# EAGLE design LayerOne_2011_bkt (EAGLE 5.11)
MF: VISHAY/DALE; MPN: CRCW080510K0FKEA; OC_NEWARK: 52K9795

## Sheet 1 of 4
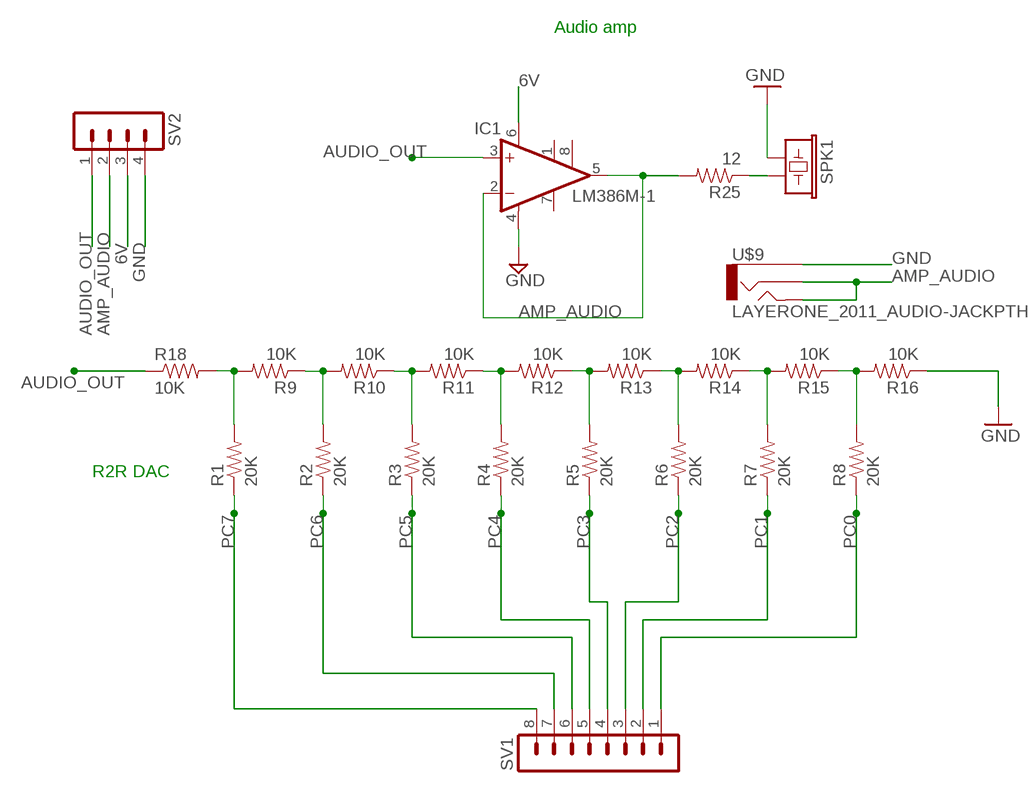
[diagram p0: schematic, sheet 1]

### Parts
IC1  LM386M-1  [SO08]
R1  20K  RESISTOR  [0805]
R2  20K  RESISTOR  [0805]
R3  20K  RESISTOR  [0805]
R4  20K  RESISTOR  [0805]
R5  20K  RESISTOR  [0805]
R6  20K  RESISTOR  [0805]
R7  20K  RESISTOR  [0805]
R8  20K  RESISTOR  [0805]
R9  10K  RESISTOR  [0805]
R10  10K  RESISTOR  [0805]
R11  10K  RESISTOR  [0805]
R12  10K  RESISTOR  [0805]
R13  10K  RESISTOR  [0805]
R14  10K  RESISTOR  [0805]
R15  10K  RESISTOR  [0805]
R16  10K  RESISTOR  [0805]
R18  10K  RESISTOR  [0805]
R25  12  RESISTOR  [0805]
SPK1  BUZZERSMD2  [BUZZER-CCV]
SV1  MA08-1  [MA08-1]
SV2  MA04-1  [MA04-1]
U$9  LAYERONE_2011_AUDIO-JACKPTH  [LAYERONE_2011_AUDIO-JACK]

### Nets
6V: IC1.6(VS) SV2.3
AMP_AUDIO: IC1.2(-IN) IC1.5(OUT) R25.2 SV2.2 U$9.2 U$9.5
AUDIO_OUT: IC1.3(+IN) R18.1 SV2.1
GND: IC1.4(GND) R16.1 SPK1.+ SV2.4 U$9.1 ; also sheet 4
N$1: R2.2 R9.1 R10.2
N$2: R3.2 R10.1 R11.2
N$3: R4.2 R11.1 R12.2
N$4: R5.2 R12.1 R13.2
N$5: R6.2 R13.1 R14.2
N$6: R7.2 R14.1 R15.2
N$7: R8.2 R15.1 R16.2
N$8: R25.1 SPK1.-
N$53: R1.2 R9.2 R18.2
PC0: R8.1 SV1.1
PC1: R7.1 SV1.2
PC2: R6.1 SV1.3
PC3: R5.1 SV1.4
PC4: R4.1 SV1.5
PC5: R3.1 SV1.6
PC6: R2.1 SV1.7
PC7: R1.1 SV1.8
Unconnected: IC1.1(GAIN) IC1.7(BYPASS) IC1.8(GAIN)

### Notes on the sheet
- Audio amp
- R2R DAC

## Sheet 2 of 4
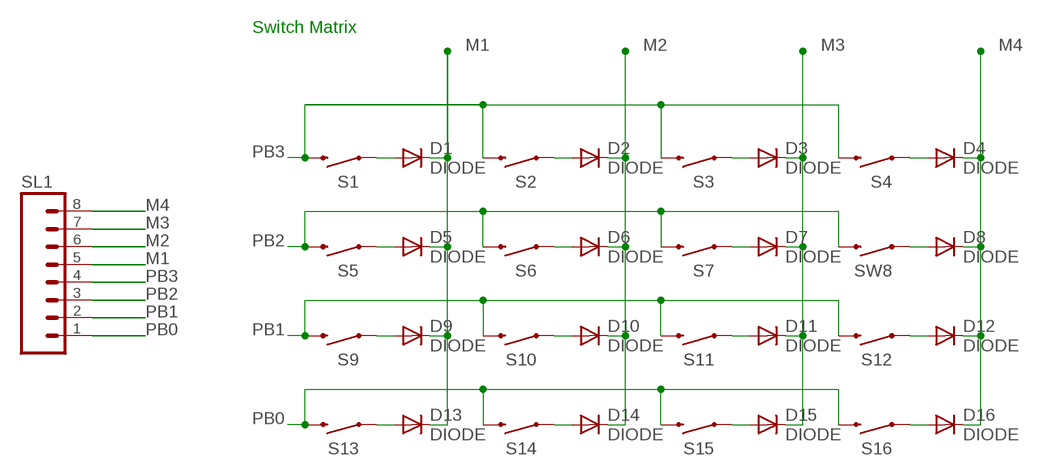
[diagram p1: schematic, sheet 2]

### Parts
D1  DIODE  DIODESOD  [SOD-323]
D2  DIODE  DIODESOD  [SOD-323]
D3  DIODE  DIODESOD  [SOD-323]
D4  DIODE  DIODESOD  [SOD-323]
D5  DIODE  DIODESOD  [SOD-323]
D6  DIODE  DIODESOD  [SOD-323]
D7  DIODE  DIODESOD  [SOD-323]
D8  DIODE  DIODESOD  [SOD-323]
D9  DIODE  DIODESOD  [SOD-323]
D10  DIODE  DIODESOD  [SOD-323]
D11  DIODE  DIODESOD  [SOD-323]
D12  DIODE  DIODESOD  [SOD-323]
D13  DIODE  DIODESOD  [SOD-323]
D14  DIODE  DIODESOD  [SOD-323]
D15  DIODE  DIODESOD  [SOD-323]
D16  DIODE  DIODESOD  [SOD-323]
S1  SWITCH-MOMENTARY-2SMD  [TACTILE_SWITCH_SMD]
S2  SWITCH-MOMENTARY-2SMD  [TACTILE_SWITCH_SMD]
S3  SWITCH-MOMENTARY-2SMD  [TACTILE_SWITCH_SMD]
S4  SWITCH-MOMENTARY-2SMD  [TACTILE_SWITCH_SMD]
S5  SWITCH-MOMENTARY-2SMD  [TACTILE_SWITCH_SMD]
S6  SWITCH-MOMENTARY-2SMD  [TACTILE_SWITCH_SMD]
S7  SWITCH-MOMENTARY-2SMD  [TACTILE_SWITCH_SMD]
S9  SWITCH-MOMENTARY-2SMD  [TACTILE_SWITCH_SMD]
S10  SWITCH-MOMENTARY-2SMD  [TACTILE_SWITCH_SMD]
S11  SWITCH-MOMENTARY-2SMD  [TACTILE_SWITCH_SMD]
S12  SWITCH-MOMENTARY-2SMD  [TACTILE_SWITCH_SMD]
S13  SWITCH-MOMENTARY-2SMD  [TACTILE_SWITCH_SMD]
S14  SWITCH-MOMENTARY-2SMD  [TACTILE_SWITCH_SMD]
S15  SWITCH-MOMENTARY-2SMD  [TACTILE_SWITCH_SMD]
S16  SWITCH-MOMENTARY-2SMD  [TACTILE_SWITCH_SMD]
SL1  M08  [1X08]
SW8  SWITCH-MOMENTARY-2SMD  [TACTILE_SWITCH_SMD]

### Nets
M1: D1.1(C) D5.1(C) D9.1(C) D13.1(C) SL1.5
M2: D2.1(C) D6.1(C) D10.1(C) D14.1(C) SL1.6
M3: D3.1(C) D7.1(C) D11.1(C) D15.1(C) SL1.7
M4: D4.1(C) D8.1(C) D12.1(C) D16.1(C) SL1.8
N$13: D1.2(A) S1.1
N$16: D2.2(A) S2.1
N$17: D3.2(A) S3.1
N$18: D4.2(A) S4.1
N$19: D5.2(A) S5.1
N$20: D6.2(A) S6.1
N$21: D7.2(A) S7.1
N$22: D8.2(A) SW8.1
N$23: D9.2(A) S9.1
N$24: D10.2(A) S10.1
N$25: D11.2(A) S11.1
N$26: D12.2(A) S12.1
N$33: D13.2(A) S13.1
N$34: D14.2(A) S14.1
N$35: D15.2(A) S15.1
N$36: D16.2(A) S16.1
PB0: S13.3 S14.3 S15.3 S16.3 SL1.1
PB1: S9.3 S10.3 S11.3 S12.3 SL1.2
PB2: S5.3 S6.3 S7.3 SL1.3 SW8.3
PB3: S1.3 S2.3 S3.3 S4.3 SL1.4

### Notes on the sheet
- Switch Matrix

## Sheet 3 of 4
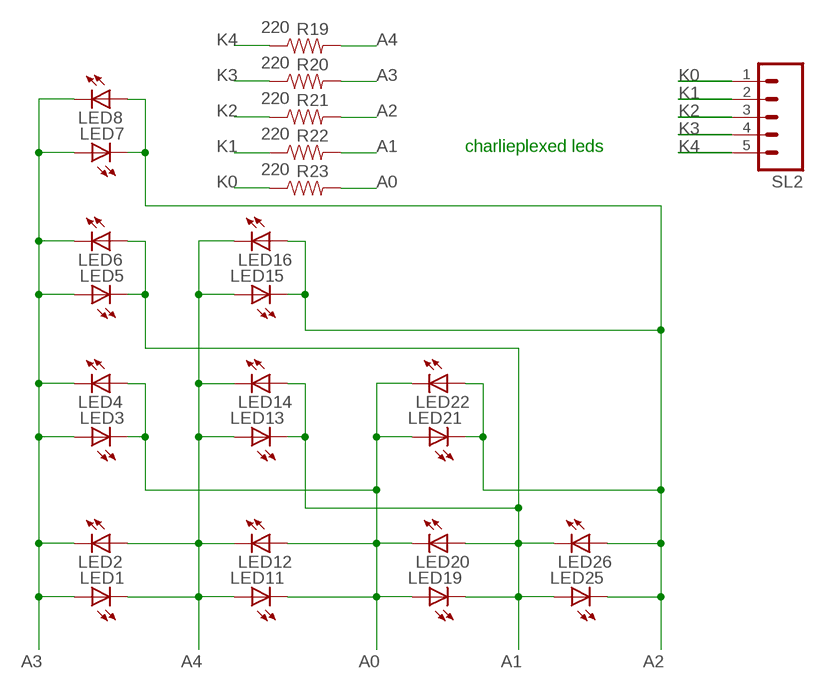
[diagram p2: schematic, sheet 3]

### Parts
LED1  LEDCHIPLED_1206  [CHIPLED_1206]
LED2  LEDCHIPLED_1206  [CHIPLED_1206]
LED3  LEDCHIPLED_1206  [CHIPLED_1206]
LED4  LEDCHIPLED_1206  [CHIPLED_1206]
LED5  LEDCHIPLED_1206  [CHIPLED_1206]
LED6  LEDCHIPLED_1206  [CHIPLED_1206]
LED7  LEDCHIPLED_1206  [CHIPLED_1206]
LED8  LEDCHIPLED_1206  [CHIPLED_1206]
LED11  LEDCHIPLED_1206  [CHIPLED_1206]
LED12  LEDCHIPLED_1206  [CHIPLED_1206]
LED13  LEDCHIPLED_1206  [CHIPLED_1206]
LED14  LEDCHIPLED_1206  [CHIPLED_1206]
LED15  LEDCHIPLED_1206  [CHIPLED_1206]
LED16  LEDCHIPLED_1206  [CHIPLED_1206]
LED19  LEDCHIPLED_1206  [CHIPLED_1206]
LED20  LEDCHIPLED_1206  [CHIPLED_1206]
LED21  LEDCHIPLED_1206  [CHIPLED_1206]
LED22  LEDCHIPLED_1206  [CHIPLED_1206]
LED25  LEDCHIPLED_1206  [CHIPLED_1206]
LED26  LEDCHIPLED_1206  [CHIPLED_1206]
R19  220  RESISTOR  [0805]
R20  220  RESISTOR  [0805]
R21  220  RESISTOR  [0805]
R22  220  RESISTOR  [0805]
R23  220  RESISTOR  [0805]
SL2  M05LOCK  [1X05_LOCK]

### Nets
A0 [LED]: LED3.C LED4.A LED11.C LED12.A LED19.A LED20.C LED21.A LED22.C R23.2
A1: LED5.C LED6.A LED13.C LED14.A LED19.C LED20.A LED25.A LED26.C R22.2
A2: LED7.C LED8.A LED15.C LED16.A LED21.C LED22.A LED25.C LED26.A R21.2
A3: LED1.A LED2.C LED3.A LED4.C LED5.A LED6.C LED7.A LED8.C R20.2
A4: LED1.C LED2.A LED11.A LED12.C LED13.A LED14.C LED15.A LED16.C R19.2
K0 [LED]: R23.1 SL2.1
K1 [LED]: R22.1 SL2.2
K2 [LED]: R21.1 SL2.3
K3 [LED]: R20.1 SL2.4
K4 [LED]: R19.1 SL2.5

### Notes on the sheet
- charlieplexed leds

## Sheet 4 of 4
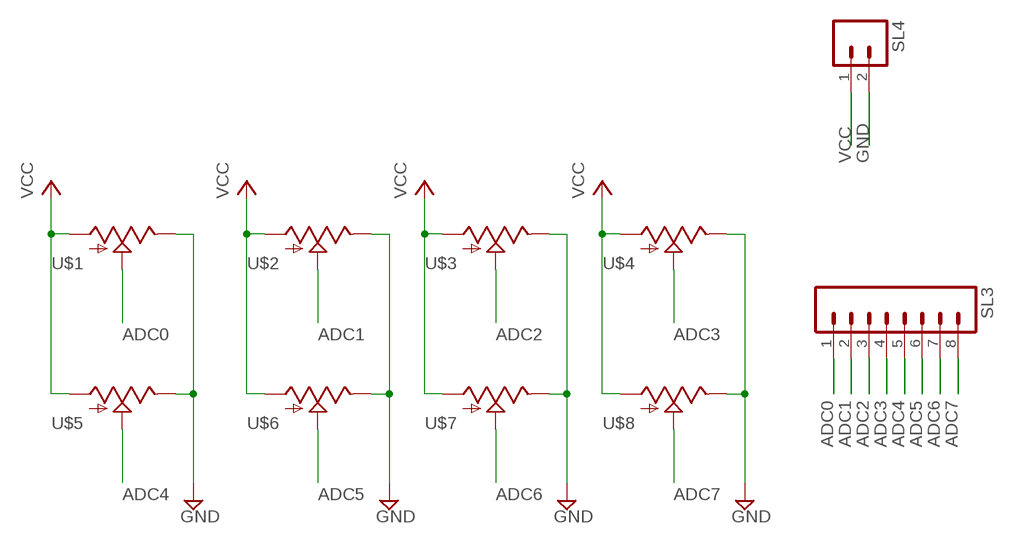
[diagram p3: schematic, sheet 4]

### Parts
SL3  M08  [1X08]
SL4  M02LOCK  [1X02_LOCK]
U$1  LAYERONE_2011_POTPOT_GOLD  [LAYERONE_2011_POT_GOLD]
U$2  LAYERONE_2011_POTPOT_GOLD  [LAYERONE_2011_POT_GOLD]
U$3  LAYERONE_2011_POTPOT_GOLD  [LAYERONE_2011_POT_GOLD]
U$4  LAYERONE_2011_POTPOT_GOLD  [LAYERONE_2011_POT_GOLD]
U$5  LAYERONE_2011_POTPOT_GOLD  [LAYERONE_2011_POT_GOLD]
U$6  LAYERONE_2011_POTPOT_GOLD  [LAYERONE_2011_POT_GOLD]
U$7  LAYERONE_2011_POTPOT_GOLD  [LAYERONE_2011_POT_GOLD]
U$8  LAYERONE_2011_POTPOT_GOLD  [LAYERONE_2011_POT_GOLD]

### Nets
ADC0: SL3.1 U$1.P$2(S)
ADC1: SL3.2 U$2.P$2(S)
ADC2: SL3.3 U$3.P$2(S)
ADC3: SL3.4 U$4.P$2(S)
ADC4: SL3.5 U$5.P$2(S)
ADC5: SL3.6 U$6.P$2(S)
ADC6: SL3.7 U$7.P$2(S)
ADC7: SL3.8 U$8.P$2(S)
GND: SL4.2 U$1.P$3(E) U$2.P$3(E) U$3.P$3(E) U$4.P$3(E) U$5.P$3(E) U$6.P$3(E) U$7.P$3(E) U$8.P$3(E) ; also sheet 1
VCC: SL4.1 U$1.P$1(A) U$2.P$1(A) U$3.P$1(A) U$4.P$1(A) U$5.P$1(A) U$6.P$1(A) U$7.P$1(A) U$8.P$1(A)

## Library data of the parts
D1-D16 = SparkFun:DIODE: Diode These are standard reverse protection diodes and small signal diodes. SMA package can handle up to about 1A. SOD-323 can handle about 200mA. What the SOD-323 package when ordering, there are some mfgs out there that are 5-pin packages.
IC1 = LayerOne_2011:LM386?-*: Low Voltage Audio Power Amplifier Source: http://cache.national.com/ds/LM/LM386.pdf
LED1-LED8 LED11-LED16 LED19-LED22 LED25 LED26 = led:LED: LED OSRAM: - CHIPLED LG R971, LG N971, LY N971, LG Q971, LY Q971, LO R971, LY R971 LH N974, LH R974 LS Q976, LO Q976, LY Q976 LO Q996 - Hyper CHIPLED LW Q18S LB Q993, LB Q99A, LB R99A - SideLED LS A670, LO A670, LY A670, LG A670, LP A670 LB A673, LV A673, LT A673, LW A673 LH A674 LY A675 LS A676, LA A676, LO A676, LY A676, LW A676 LS A679, LY A679, LG A679 - Hyper Micro SIDELED® LS Y876, LA Y876, LO Y876, LY Y876 LT Y87S - SmartLED LW L88C, LW L88S LB L89C, LB L89S, LG L890 LS L89K, LO L89K, LY L89K LS L896, LA L896, LO L896, LY L896 - TOPLED LS T670, LO T670, LY T670, LG T670, LP T670 LSG T670, LSP T670, LSY T670, LOP T670, LYG T670 LG T671, LOG T671, LSG T671 LB T673, LV T673, LT T673, LW T673 LH T674 LS T676, LA T676, LO T676, LY T676, LB T676, LH T676, LSB T676, LW T676 LB T67C, LV T67C, LT T67C, LS T67K, LO T67K, LY T67K, LW E67C LS E67B, LA E67B, LO E67B, LY E67B, LB E67C, LV E67C, LT E67C LW T67C LS T679, LY T679, LG T679 LS T770, LO T770, LY T770, LG T770, LP T770 LB T773, LV T773, LT T773, LW T773 LH T774 LS E675, LA E675, LY E675, LS T675 LS T776, LA T776, LO T776, LY T776, LB T776 LHGB T686 LT T68C, LB T68C - Hyper Mini TOPLED® LB M676 - Mini TOPLED Santana® LG M470 LS M47K, LO M47K, LY M47K Source: http://www.osram.convergy.de LUXEON: - LUMILED® LXK2-PW12-R00, LXK2-PW12-S00, LXK2-PW14-U00, LXK2-PW14-V00 LXK2-PM12-R00, LXK2-PM12-S00, LXK2-PM14-U00 LXK2-PE12-Q00, LXK2-PE12-R00, LXK2-PE12-S00, LXK2-PE14-T00, LXK2-PE14-U00 LXK2-PB12-K00, LXK2-PB12-L00, LXK2-PB12-M00, LXK2-PB14-N00, LXK2-PB14-P00, LXK2-PB14-Q00 LXK2-PR12-L00, LXK2-PR12-M00, LXK2-PR14-Q00, LXK2-PR14-R00 LXK2-PD12-Q00, LXK2-PD12-R00, LXK2-PD12-S00 LXK2-PH12-R00, LXK2-PH12-S00 LXK2-PL12-P00, LXK2-PL12-Q00, LXK2-PL12-R00 Source: www.luxeon.com KINGBRIGHT: KA-3528ASYC Source: www.kingbright.com
R1-R16 R25 = SparkFun:RESISTOR: Resistor Basic schematic elements and footprints for 0603, 1206, and PTH 1/10th watt (small) resistors.
R18 = LayerOne_2011:RESISTOR: Resistor Basic schematic elements and footprints for 0603, 1206, and PTH 1/10th watt (small) resistors.
R19-R23 = NSL:RESISTOR: Resistor Basic schematic elements and footprints for 0603, 1206, and PTH 1/10th watt (small) resistors.
S1-S7 S9-S16 SW8 = LayerOne_2011:SWITCH-MOMENTARY-2
SL1 SL3 = SparkFun:M08: Header 8 Standard 8-pin 0.1" header. Use with straight break away headers (SKU : PRT-00116), right angle break away headers (PRT-00553), swiss pins (PRT-00743), machine pins (PRT-00117), and female headers (PRT-00115).
SL2 = SparkFun:M05: Header 5 Standard 5-pin 0.1" header. Use with straight break away headers (SKU : PRT-00116), right angle break away headers (PRT-00553), swiss pins (PRT-00743), machine pins (PRT-00117), and female headers (PRT-00115). Molex polarized connector foot print use with SKU : PRT-08230 with associated crimp pins and housings.
SL4 = SparkFun:M02: Header 2 Standard 2-pin 0.1" header. Use with straight break away headers (SKU : PRT-00116), right angle break away headers (PRT-00553), swiss pins (PRT-00743), machine pins (PRT-00117), and female headers (PRT-00115). Molex polarized connector foot print use with SKU : PRT-08233 with associated crimp pins and housings.
SPK1 = LayerOne_2011:BUZZER: Buzzer 12mm Spark Fun Electronics SKU : Comp-Buzzer
SV1 = con-lstb:MA08-1: PIN HEADER; OC_FARNELL: unknown; OC_NEWARK: unknown
SV2 = con-lstb:MA04-1: PIN HEADER; OC_FARNELL: unknown; OC_NEWARK: unknown
U$1-U$8 = LayerOne_2011:LAYERONE_2011_POT
U$9 = LayerOne_2011:LAYERONE_2011_AUDIO-JACK: 3.5mm Audio Jack Simple 3.5mm common PCB mount audio jack. SKU: PRT-08032

## Net classes
0 default: width 0.406 mm
1 LED: width 0.305 mm

## Board
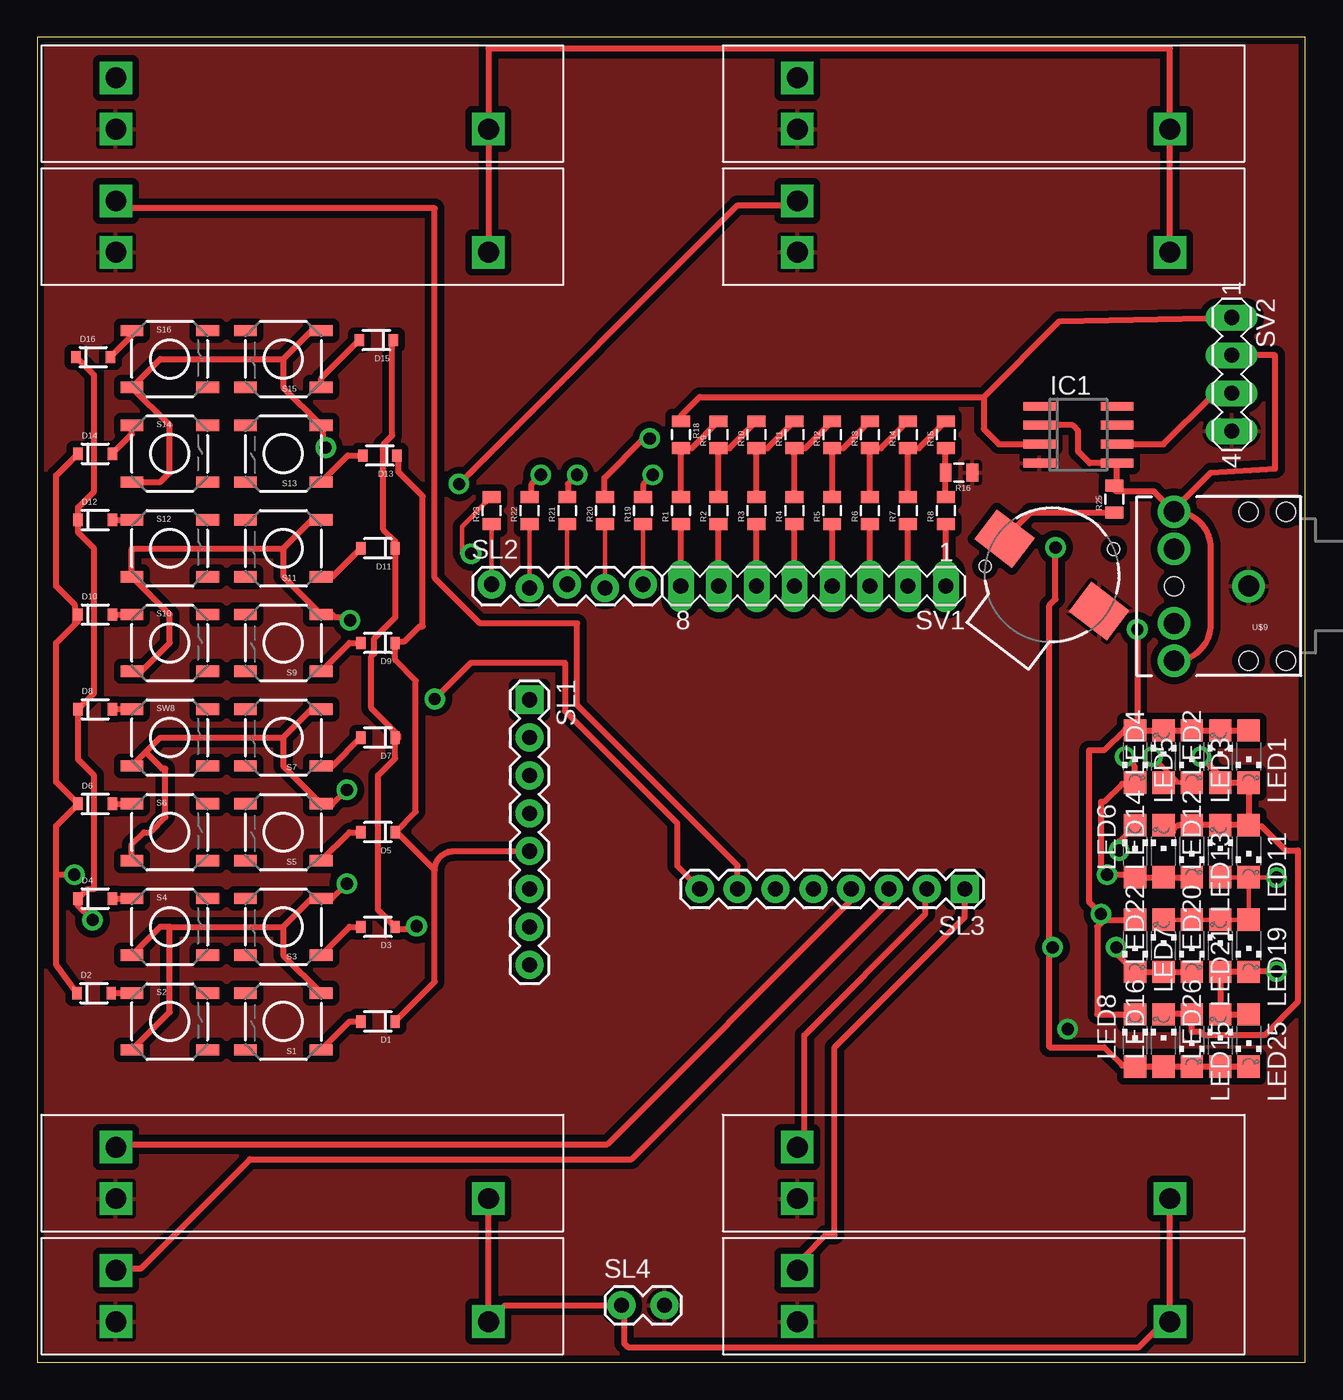
[diagram p4: board, top side]
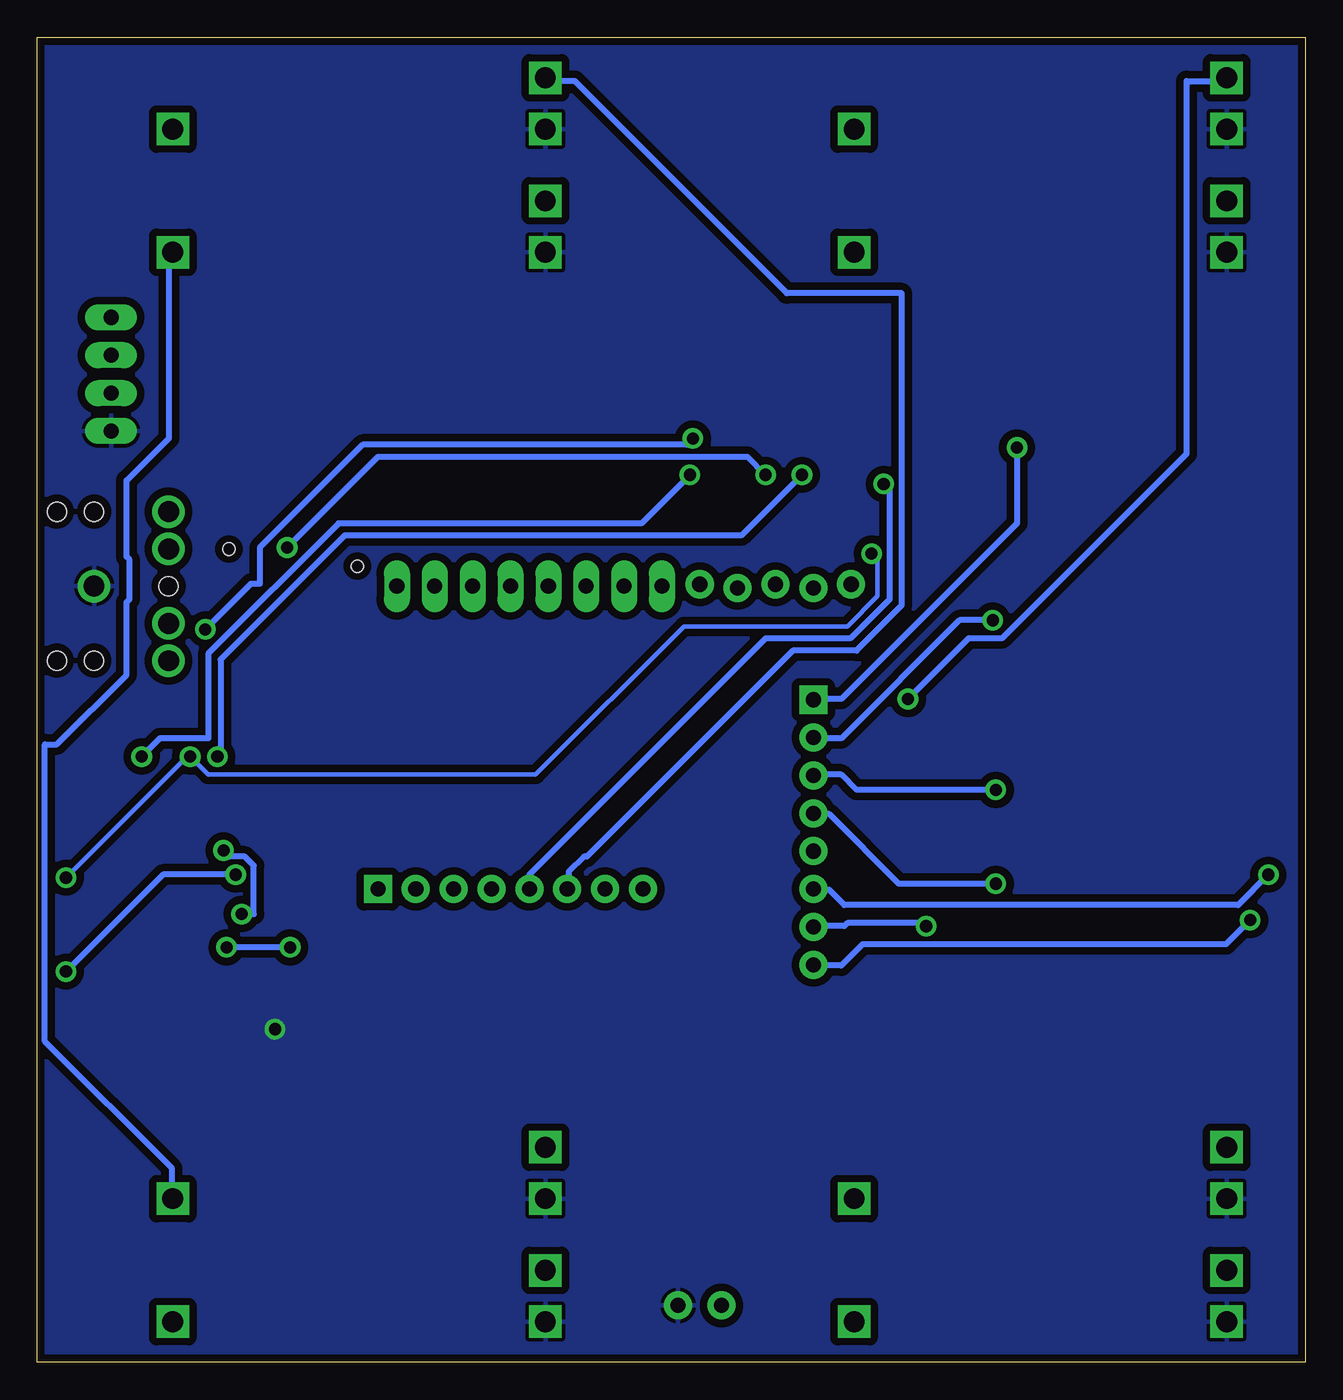
[diagram p5: board, bottom side, seen from below]

Size 85.09 x 88.9 mm. Coordinates in mm from the lower left corner, seen from the top.
Outline: 0,0 85.09,0 85.09,88.9 0,88.9 0,0
Copper layers (1*16): Top 0.0356mm / dielectric 1.5011mm / Bottom 0.0356mm
Design rules "SparkFun-mod *": minimum track width 8mil, minimum drill 32mil, track to track 14mil, track to pad 14mil, pad to pad 12mil, via to via 12mil, smd to smd 8mil, copper to edge 12mil, drill to drill 8mil, minimum pad ring 14mil, minimum via ring 10mil, stop-mask expansion 4mil, vias tented up to drill 34mil, thermal gap 10mil
Milling: 4 lines

### Footprints (pad centres in the part's own frame; a part is rotated, then mirrored left to right if it is on the bottom)
SOD-323 = smd 0.63 x 0.83: 1 -1.15,0; 2 1.15,0
SO08 = smd 0.6 x 2.2: 1 -1.905,-2.6; 2 -0.635,-2.6; 3 0.635,-2.6; 4 1.905,-2.6; 5 1.905,2.6; 6 0.635,2.6; 7 -0.635,2.6; 8 -1.905,2.6
CHIPLED_1206 = smd 1.5 x 1.5: A 0,-1.75; C 0,1.75
0805 = smd 0.8 x 1.2: 1 -0.9,0; 2 0.9,0
TACTILE_SWITCH_SMD = smd 1.524 x 0.762: 1 -2.54,1.905; 2 2.54,1.905; 3 -2.54,-1.905; 4 2.54,-1.905
1X08 = drill 1.016 pad 1.88 square: 1 0,0 | drill 1.016 pad 1.88 round: 2 2.54,0; 3 5.08,0; 4 7.62,0; 5 10.16,0; 6 12.7,0; 7 15.24,0; 8 17.78,0
1X05_LOCK = drill 1.016 pad 1.88 round: 1 0,0.127; 2 2.54,-0.127; 3 5.08,0.127; 4 7.62,-0.127; 5 10.16,0.127
1X02_LOCK = drill 1.016 pad 1.88 round: 1 -0.178,0; 2 2.718,0
BUZZER-CCV = smd 3.2 x 2.5: + 4,0; - -4,0 | hole 0.813: -3.9,-2.25; 2.25,3.9
MA08-1 = drill 1.016 long: 1 -8.89,0; 2 -6.35,0; 3 -3.81,0; 4 -1.27,0; 5 1.27,0; 6 3.81,0; 7 6.35,0; 8 8.89,0
MA04-1 = drill 1.016 long: 1 -3.81,0; 2 -1.27,0; 3 1.27,0; 4 3.81,0
LAYERONE_2011_POT_GOLD = drill 1.397 square: P$1 12.5,-1.72; P$2 -12.5,1.72; P$3 -12.5,-1.72
LAYERONE_2011_AUDIO-JACK = drill 1.397 pad 2.184 round: 1 0,0; 2 5,5; 3 5,2.5; 4 5,-2.5; 5 5,-5 | hole 1.27: 0,5; -2.5,5; -2.5,-5; 0,-5; 5,0

### Placement (x,y rotation side)
D1  22.86,22.86 180 top
D2  3.81,24.77 0 top
D3  22.86,29.21 180 top
D4  3.89,31.11 0 top
D5  22.86,35.56 180 top
D6  3.89,37.47 0 top
D7  22.86,41.91 180 top
D8  3.89,43.81 0 top
D9  22.86,48.26 180 top
D10  3.89,50.16 0 top
D11  22.86,54.61 180 top
D12  3.89,56.52 0 top
D13  22.99,60.83 180 top
D14  3.89,60.96 0 top
D15  22.75,68.58 180 top
D16  3.76,67.44 0 top
IC1  69.85,62.23 270 top
LED1  81.28,40.64 180 top
LED2  79.38,40.64 0 top
LED3  77.47,40.64 180 top
LED4  75.56,40.64 0 top
LED5  73.66,40.64 180 top
LED6  73.66,34.29 0 top
LED7  73.66,27.94 180 top
LED8  73.66,21.59 0 top
LED11  81.28,34.29 180 top
LED12  79.38,34.29 0 top
LED13  77.47,34.29 180 top
LED14  75.56,34.29 0 top
LED15  77.47,21.59 180 top
LED16  75.56,21.59 0 top
LED19  81.28,27.94 180 top
LED20  79.38,27.94 0 top
LED21  77.47,27.94 180 top
LED22  75.56,27.94 0 top
LED25  81.28,21.59 180 top
LED26  79.38,21.59 0 top
R1  43.18,57.15 90 top
R2  45.72,57.15 90 top
R3  48.26,57.15 90 top
R4  50.8,57.15 90 top
R5  53.34,57.15 90 top
R6  55.88,57.15 90 top
R7  58.42,57.15 90 top
R8  60.96,57.15 90 top
R9  45.72,62.23 90 top
R10  48.26,62.23 90 top
R11  50.8,62.23 90 top
R12  53.34,62.23 90 top
R13  55.88,62.23 90 top
R14  58.42,62.23 90 top
R15  60.96,62.23 90 top
R16  61.85,59.69 180 top
R18  43.18,62.23 270 top
R19  40.64,57.15 90 top
R20  38.1,57.15 90 top
R21  35.56,57.15 90 top
R22  33.02,57.15 90 top
R23  30.48,57.15 90 top
R25  72.26,57.91 90 top
S1  16.51,22.86 180 top
S2  8.89,22.86 0 top
S3  16.51,29.21 180 top
S4  8.89,29.21 0 top
S5  16.51,35.56 180 top
S6  8.89,35.56 0 top
S7  16.51,41.91 180 top
S9  16.51,48.26 180 top
S10  8.89,48.26 0 top
S11  16.51,54.61 180 top
S12  8.89,54.61 0 top
S13  16.51,60.96 180 top
S14  8.89,60.96 0 top
S15  16.51,67.31 180 top
S16  8.89,67.31 0 top
SL1  33.02,44.45 270 top
SL2  30.48,52.07 0 top
SL3  62.23,31.75 180 top
SL4  39.37,3.81 0 top
SPK1  68.07,52.83 322.6 top
SV1  52.07,52.07 180 top
SV2  80.14,66.29 270 top
SW8  8.89,41.91 0 top
U$1  63.5,4.45 0 top
U$2  63.5,12.7 0 top
U$3  17.78,4.45 0 top
U$4  17.78,12.7 0 top
U$5  63.5,76.2 0 top
U$6  63.5,84.45 0 top
U$7  17.78,76.2 0 top
U$8  17.78,84.45 0 top
U$9  81.28,52.07 180 top

### Tracks (layer width: path | path; a pad name or v marks a point on that pad's centre or on a via)
6V
  Top 0.406: IC1.6 75.56,61.59 78.74,64.77 79.88,64.77 SV2.3
A0  (via drill 0.81)
  Top 0.305: LED11.C LED12.A | LED11.C LED19.A LED20.C LED21.A LED22.C | 76.45,38.89 LED4.A | 76.45,38.89 LED3.C | v29.11,54.25 28.5,54.25 28.5,56.08 30.33,57.91 R23.2 | v74.83,40.64 76.45,39.01 76.45,38.89 | v83.16,32.51 81.33,32.51 LED11.C
  Bottom 0.305: v29.11,54.25 28.7,53.85 28.7,51.41 30.73,49.38 41.71,49.38 51.66,39.42 73.61,39.42 v74.83,40.64 74.83,40.44 75.23,40.44 v83.16,32.51
A1  (via drill 0.81)
  Top 0.406: 80.01,23.34 LED26.C | 80.01,23.34 LED25.A | 80.01,23.34 arc-90 79.38,23.98 LED20.A LED19.C 81.33,26.21 v83.16,26.21 | LED13.C 77.47,32.51 75.64,32.51 LED14.A 75.44,32.51 73.81,32.51 LED6.A 73.61,32.72 71.98,32.72 71.88,32.82 | v33.78,59.54 33.17,58.93 33.17,58.12 R22.2 | v73,40.64 73.61,40.03 73.61,39.01 LED5.C 73.61,38.81 72.8,38.81 71.58,37.59 71.37,37.59 71.37,33.33 71.88,32.82 | 71.88,32.82 v71.78,32.72
  Bottom 0.406: v33.78,59.54 37.85,55.47 64.47,55.47 72.8,47.14 72.8,40.64 v73,40.64 | v83.16,26.21 76.66,32.72 v71.78,32.72
A2  (via drill 0.81)
  Top 0.406: LED25.C LED26.A LED15.C LED16.A LED8.A 73.61,19.91 72.8,19.91 71.58,21.13 67.92,21.13 67.92,27.84 | LED21.C LED22.A LED7.C 73.61,26.21 72.39,27.43 v72.39,27.84 | v36.22,59.54 35.61,58.93 35.61,58.12 R21.2 | v68.33,54.66 68.33,51.21 67.92,50.8 67.92,27.84 | 67.92,27.84 v68.12,27.84
  Bottom 0.406: v36.22,59.54 37.44,60.76 62.23,60.76 v68.33,54.66 | v68.12,27.84 v72.39,27.84
A3  (via drill 0.81)
  Top 0.406: LED8.C 71.12,23.34 71.12,29.21 71.6,29.69 | 71.6,29.69 LED7.A | LED1.A LED2.C LED3.A LED4.C LED5.A | v72.59,34.34 72.59,34.95 73.61,35.97 LED6.C | 71.6,29.69 71.58,29.87 v71.37,30.07 70.56,30.89 70.56,41.05 71.58,41.05 73,42.47 73.61,42.47 LED5.A | v41.1,61.98 40.69,61.98 38.05,59.33 38.05,58.12 R20.2 | v73.81,49.17 73.81,42.47 LED5.A
  Bottom 0.406: v72.59,34.34 72.19,33.93 71.17,33.93 70.56,33.33 70.56,30.07 v71.37,30.07 | v41.1,61.98 41.5,61.57 63.25,61.57 70.16,54.66 70.16,52.22 70.76,52.22 v73.81,49.17
A4  (via drill 0.81)
  Top 0.406: LED11.A LED1.C LED2.A 79.7,39.01 v78.08,40.64 | LED11.A LED12.C LED13.A 76.68,36.04 arc90 76.2,35.56 76.05,35.56 arc-90 LED14.C | LED16.C 75.64,23.37 77.47,23.37 LED15.A 77.47,22.15 78.08,22.15 78.28,21.95 82.35,21.95 84.58,24.18 84.58,34.34 83.77,34.34 82.14,35.97 81.33,35.97 LED11.A | v41.3,59.54 40.69,58.93 40.69,58.12 R19.2
  Bottom 0.406: v41.3,59.54 44.55,56.29 64.87,56.29 73.61,47.55 73.61,41.86 76.86,41.86 v78.08,40.64
ADC0
  Top 0.406: SL3.1 62.23,29.87 53.49,21.13 53.49,8.53 52.88,8.53 51.46,7.11 51.46,6.1 51.05,6.1 U$1.P$2
ADC1
  Top 0.406: SL3.2 59.59,31.7 59.59,30.07 51.46,21.95 51.46,14.43 51.05,14.43 U$2.P$2
ADC2
  Top 0.406: SL3.3 57.15,30.89 39.88,13.61 14.28,13.61 6.96,6.3 6.35,6.3 6.15,6.1 5.33,6.1 U$3.P$2
ADC3
  Top 0.406: SL3.4 54.51,31.7 54.51,30.89 38.25,14.63 6.35,14.63 6.15,14.43 5.33,14.43 U$4.P$2
ADC4  (via drill 0.81)
  Top 0.406: v28.3,58.93 46.99,77.62 50.04,77.62 50.24,77.83 50.85,77.83 U$5.P$2
  Bottom 0.406: v28.3,58.93 27.89,58.93 27.89,51.21 30.53,48.56 36.22,48.56 52.07,32.72 SL3.5
ADC5
  Bottom 0.406: SL3.6 49.43,31.9 49.43,32.92 48.41,33.93 48.21,33.93 34.39,47.75 30.12,47.75 27.08,50.8 27.08,71.73 34.8,71.73 49.02,85.95 50.04,85.95 50.24,86.16 50.85,86.16 U$6.P$2
ADC6
  Top 0.406: SL3.7 46.99,33.33 36.22,44.09 36.22,49.58 29.72,49.58 26.67,52.63 26.67,77.42 6.35,77.42 5.94,77.83 5.33,77.83 U$7.P$2
ADC7  (via drill 0.81)
  Top 0.406: v26.67,44.5 29.11,46.94 35.41,46.94 35.41,43.69 42.93,36.17 42.93,33.33 44.35,31.9 SL3.8
  Bottom 0.406: v26.67,44.5 22.61,48.56 20.37,48.56 7.98,60.96 7.98,85.95 6.35,85.95 6.15,86.16 5.33,86.16 U$8.P$2
AMP_AUDIO
  Top 0.406: IC1.2 69.47,62.87 69.85,62.48 69.85,61.09 70.61,60.33 IC1.5 72.45,59 R25.2 72.26,58.55 72.39,58.42 74.93,58.42 76.2,57.15 | 76.2,57.15 U$9.5 arc-90 78.74,54.61 78.74,49.53 arc-90 U$9.2 | SV2.2 83.06,67.56 83.06,59.94 78.74,59.69 76.2,57.15
AUDIO_OUT
  Top 0.406: R18.1 43.18,63.5 44.45,64.77 63.5,64.77 | 63.5,64.77 63.5,62.61 64.52,61.59 IC1.3 | SV2.1 68.58,69.85 63.5,64.77
GND  (via drill 0.81)
  other vias: 69.14,22.35
  pour Top (isolate 0.457): 85.09,88.9 0,88.9 0,0 85.09,0
  pour Bottom (isolate 0.508): 83.82,88.9 0,88.9 0,0 85.09,0 85.09,88.9
K0
  Top 0.305: SL2.1 R23.1
K1
  Top 0.305: SL2.2 R22.1
K2
  Top 0.305: SL2.3 R21.1
K3
  Top 0.305: SL2.4 38.1,55.88 38.05,55.88 38.05,56.08 R20.1
K4
  Top 0.305: SL2.5 40.64,55.88 40.69,55.88 40.69,56.08 R19.1
M1
  Top 0.406: D1.1 26.67,25.52 26.67,33.02 | 26.67,33.02 24.13,35.56 D5.1 25.4,36.95 25.4,45.72 24.01,47.11 D9.1 24.03,48.36 24.64,48.36 25.65,49.38 25.86,49.38 25.86,58.12 24.23,59.74 24.23,60.76 D13.1 | SL1.5 27.94,34.29 arc90 26.67,33.02
M2  (via drill 0.81)
  Top 0.406: D2.1 1.27,26.67 1.27,32.72 | 1.27,32.72 1.27,36 D6.1 1.27,38.93 1.27,48.26 2.54,49.53 | 2.54,49.53 2.74,49.73 D10.1 | D14.1 1.27,59.49 1.27,52.07 2.54,50.8 2.54,49.53 | 1.27,32.72 v2.49,32.72
  Bottom 0.406: v2.49,32.72 4.52,30.68 30.94,30.68 31.95,31.7 32.97,31.7 SL1.6
M3  (via drill 0.81)
  Top 0.406: D15.1 23.83,68.48 23.83,62.18 23.22,61.57 23.22,55.88 24.03,55.07 24.03,54.66 D11.1 24.03,54.46 24.03,49.99 22.61,48.56 22.61,47.55 22.4,47.35 22.4,43.89 24.23,42.06 24.23,41.86 24.03,41.86 D7.1 24.01,40.52 22.86,39.37 22.86,30.36 D3.1 24.03,29.06 25.25,29.06 v25.45,29.26
  Bottom 0.406: v25.45,29.26 25.65,29.46 30.73,29.46 30.94,29.26 32.97,29.26 SL1.7
M4  (via drill 0.81)
  Top 0.406: D16.1 3.81,66.24 3.81,58.42 2.74,57.35 D12.1 2.74,55.68 3.81,54.61 3.81,44.89 D8.1 2.74,40.44 3.81,39.37 3.81,31.75 3.37,31.75 D4.1 2.69,31.09 2.69,30.68 v3.71,29.67
  Bottom 0.406: v3.71,29.67 5.33,28.04 29.72,28.04 31.14,26.62 32.97,26.62 SL1.8
N$1
  Top 0.406: R2.2 R9.1 46.46,61.33 R10.2
N$2
  Top 0.406: R3.2 R10.1 49,61.33 R11.2
N$3
  Top 0.406: R4.2 R11.1 51.54,61.33 R12.2
N$4
  Top 0.406: R5.2 R12.1 54.08,61.33 R13.2
N$5
  Top 0.406: R6.2 R13.1 56.62,61.33 R14.2
N$6
  Top 0.406: R7.2 R14.1 59.16,61.33 R15.2
N$7
  Top 0.406: R8.2 R16.2 R15.1
N$8
  Top 0.406: R25.1 66.64,57.01 SPK1.-
N$13
  Top 0.406: S1.1 20.96,22.86 D1.2
N$16
  Top 0.406: D2.2 S2.1
N$17
  Top 0.406: S3.1 20.96,29.21 D3.2
N$18
  Top 0.406: D4.2 S4.1
N$19
  Top 0.406: S5.1 20.96,35.56 D5.2
N$20
  Top 0.406: D6.2 S6.1
N$21
  Top 0.406: D7.2 19.8,40.01 S7.1
N$22
  Top 0.406: D8.2 SW8.1
N$23
  Top 0.406: S9.1 20.96,48.26 D9.2
N$24
  Top 0.406: D10.2 S10.1
N$25
  Top 0.406: D11.2 19.8,52.7 S11.1
N$26
  Top 0.406: D12.2 S12.1
N$33
  Top 0.406: S13.1 20.83,60.83 D13.2
N$34
  Top 0.406: D14.2 6.35,62.27 S14.1
N$35
  Top 0.406: D15.2 19.05,66.03 S15.1
N$36
  Top 0.406: D16.2 6.35,68.88 S16.1
N$53
  Top 0.406: R1.2 R18.2 43.92,61.33 R9.2
PB0  (via drill 0.81)
  Top 0.406: S14.3 8.25,59.05 8.89,59.69 8.89,62.87 S16.3 8.25,67.31 16.51,67.31 | 16.51,67.31 18.42,69.22 S15.3 | 16.51,67.31 16.51,65.41 S13.3 19.15,62.79 19.15,61.57 v19.36,61.37
  Bottom 0.406: v19.36,61.37 19.36,56.29 31.14,44.5 32.97,44.5 SL1.1
PB1  (via drill 0.81)
  Top 0.406: 16.51,54.61 18.42,56.52 S11.3 | S10.3 6.98,46.35 8.89,48.26 8.89,50.16 S12.3 6.35,54.61 16.51,54.61 | 16.51,54.61 16.51,52.7 S9.3 19.15,50.19 19.76,50.19 19.96,49.99 20.78,49.99 v20.98,49.78
  Bottom 0.406: v20.98,49.78 23.22,49.78 31.14,41.86 32.97,41.86 SL1.2
PB2  (via drill 0.81)
  Top 0.406: 16.51,41.91 16.51,40.01 S5.3 19.15,37.39 19.76,37.39 v20.78,38.41 | 16.51,41.91 18.42,43.81 S7.3 | 7.28,40.93 SW8.3 | 7.28,40.93 8.25,41.91 16.51,41.91 | S6.3 6.35,34.75 7.16,35.56 7.57,35.56 8.58,36.58 8.58,39.83 8.38,39.83 7.28,40.93
  Bottom 0.406: v20.78,38.41 30.12,38.41 31.14,39.42 32.97,39.42 SL1.3
PB3  (via drill 0.81)
  Top 0.406: S1.3 16.51,27.3 16.51,29.21 | 16.51,29.21 18.42,31.11 S3.3 19.15,31.09 19.76,31.09 v20.78,32.11 | S4.3 8.25,29.21 8.89,29.21 | 8.89,29.21 16.51,29.21 | S2.3 8.89,23.5 8.89,29.21
  Bottom 0.406: v20.78,32.11 27.28,32.11 31.95,36.78 32.97,36.78 SL1.4
PC0
  Top 0.406: SV1.1 R8.1
PC1
  Top 0.406: SV1.2 R7.1
PC2
  Top 0.406: SV1.3 R6.1
PC3
  Top 0.406: SV1.4 R5.1
PC4
  Top 0.406: SV1.5 R4.1
PC5
  Top 0.406: SV1.6 R3.1
PC6
  Top 0.406: SV1.7 R2.1
PC7
  Top 0.406: SV1.8 R1.1
VCC
  Top 0.406: U$4.P$1 U$3.P$1 31.36,3.81 SL4.1 39.37,3.63 39.37,1.27 39.62,1.02 73.91,1.02 75.62,2.73 U$1.P$1 U$2.P$1 | U$7.P$1 U$8.P$1 30.28,88.14 76,88.14 U$6.P$1 U$5.P$1
  Bottom 0.406: U$2.P$1 76.05,11.18 76.05,13.01 84.58,21.54 84.58,41.45 83.77,41.45 79.1,46.13 79.1,51 78.89,51.21 78.89,53.85 79.1,54.05 79.1,59.16 76.25,62 76.25,74.57 76.05,74.57 U$5.P$1

### Text on the board
_tsilk: 032.la | charliex | LayerOne | protoype | (.)v(.)